# Altium schematic sheet Face.SchDoc: TITLE GOES HERE
size C; Author: EBK; CompanyName: Vaddio; Organization: Vaddio; Address1: 131 Cheshire Lane; Address2: Minnetonka, MN  55305; Address3: www.vaddio.com; Address4: 800-572-2011; SheetNumber: 1; SheetTotal: 1
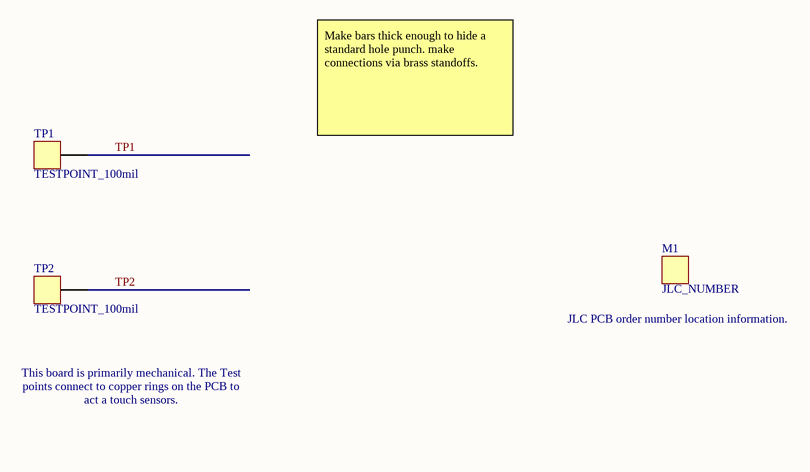
[diagram p0: Face.SchDoc]

## Parts
M1  JLC_NUMBER  [JLC_NUMBER]  (no BOM)
TP1  TESTPOINT_100mil  [TESTPOINT_100mil]  (no BOM)
TP2  TESTPOINT_100mil  [TESTPOINT_100mil]  (no BOM)

## Nets
TP1: TP1.1
TP2: TP2.1

## Notes on the sheet
- Make bars thick enough to hide a standard hole punch. make connections via brass standoffs.
- This board is primarily mechanical. The Test points connect to copper rings on the PCB to act a touch sensors.
- (near M1) JLC PCB order number location information.
- Title:
- This work is licensed under a Creative Commons Attribution 4.0 International License. Derivative works should remove all Sophistry branding and ‘é’ watermark.
- Date:
- Engineer:
- Revision:
- Codename:
- Time:
- Variant:
- Sheet
- of

## Library data of the parts
M1 = JLC_NUMBER: JLC Order Number Location; PartNumber: JLC_NUMBER; Manufacturer Part Number: JLC_NUMBER
TP1 TP2 = TESTPOINT_100mil: PartNumber: TESTPOINT_100mil; Manufacturer Part Number: TESTPOINT_100mil